# Altium schematic sheet SeaTurtleIO.SchDoc
size A3
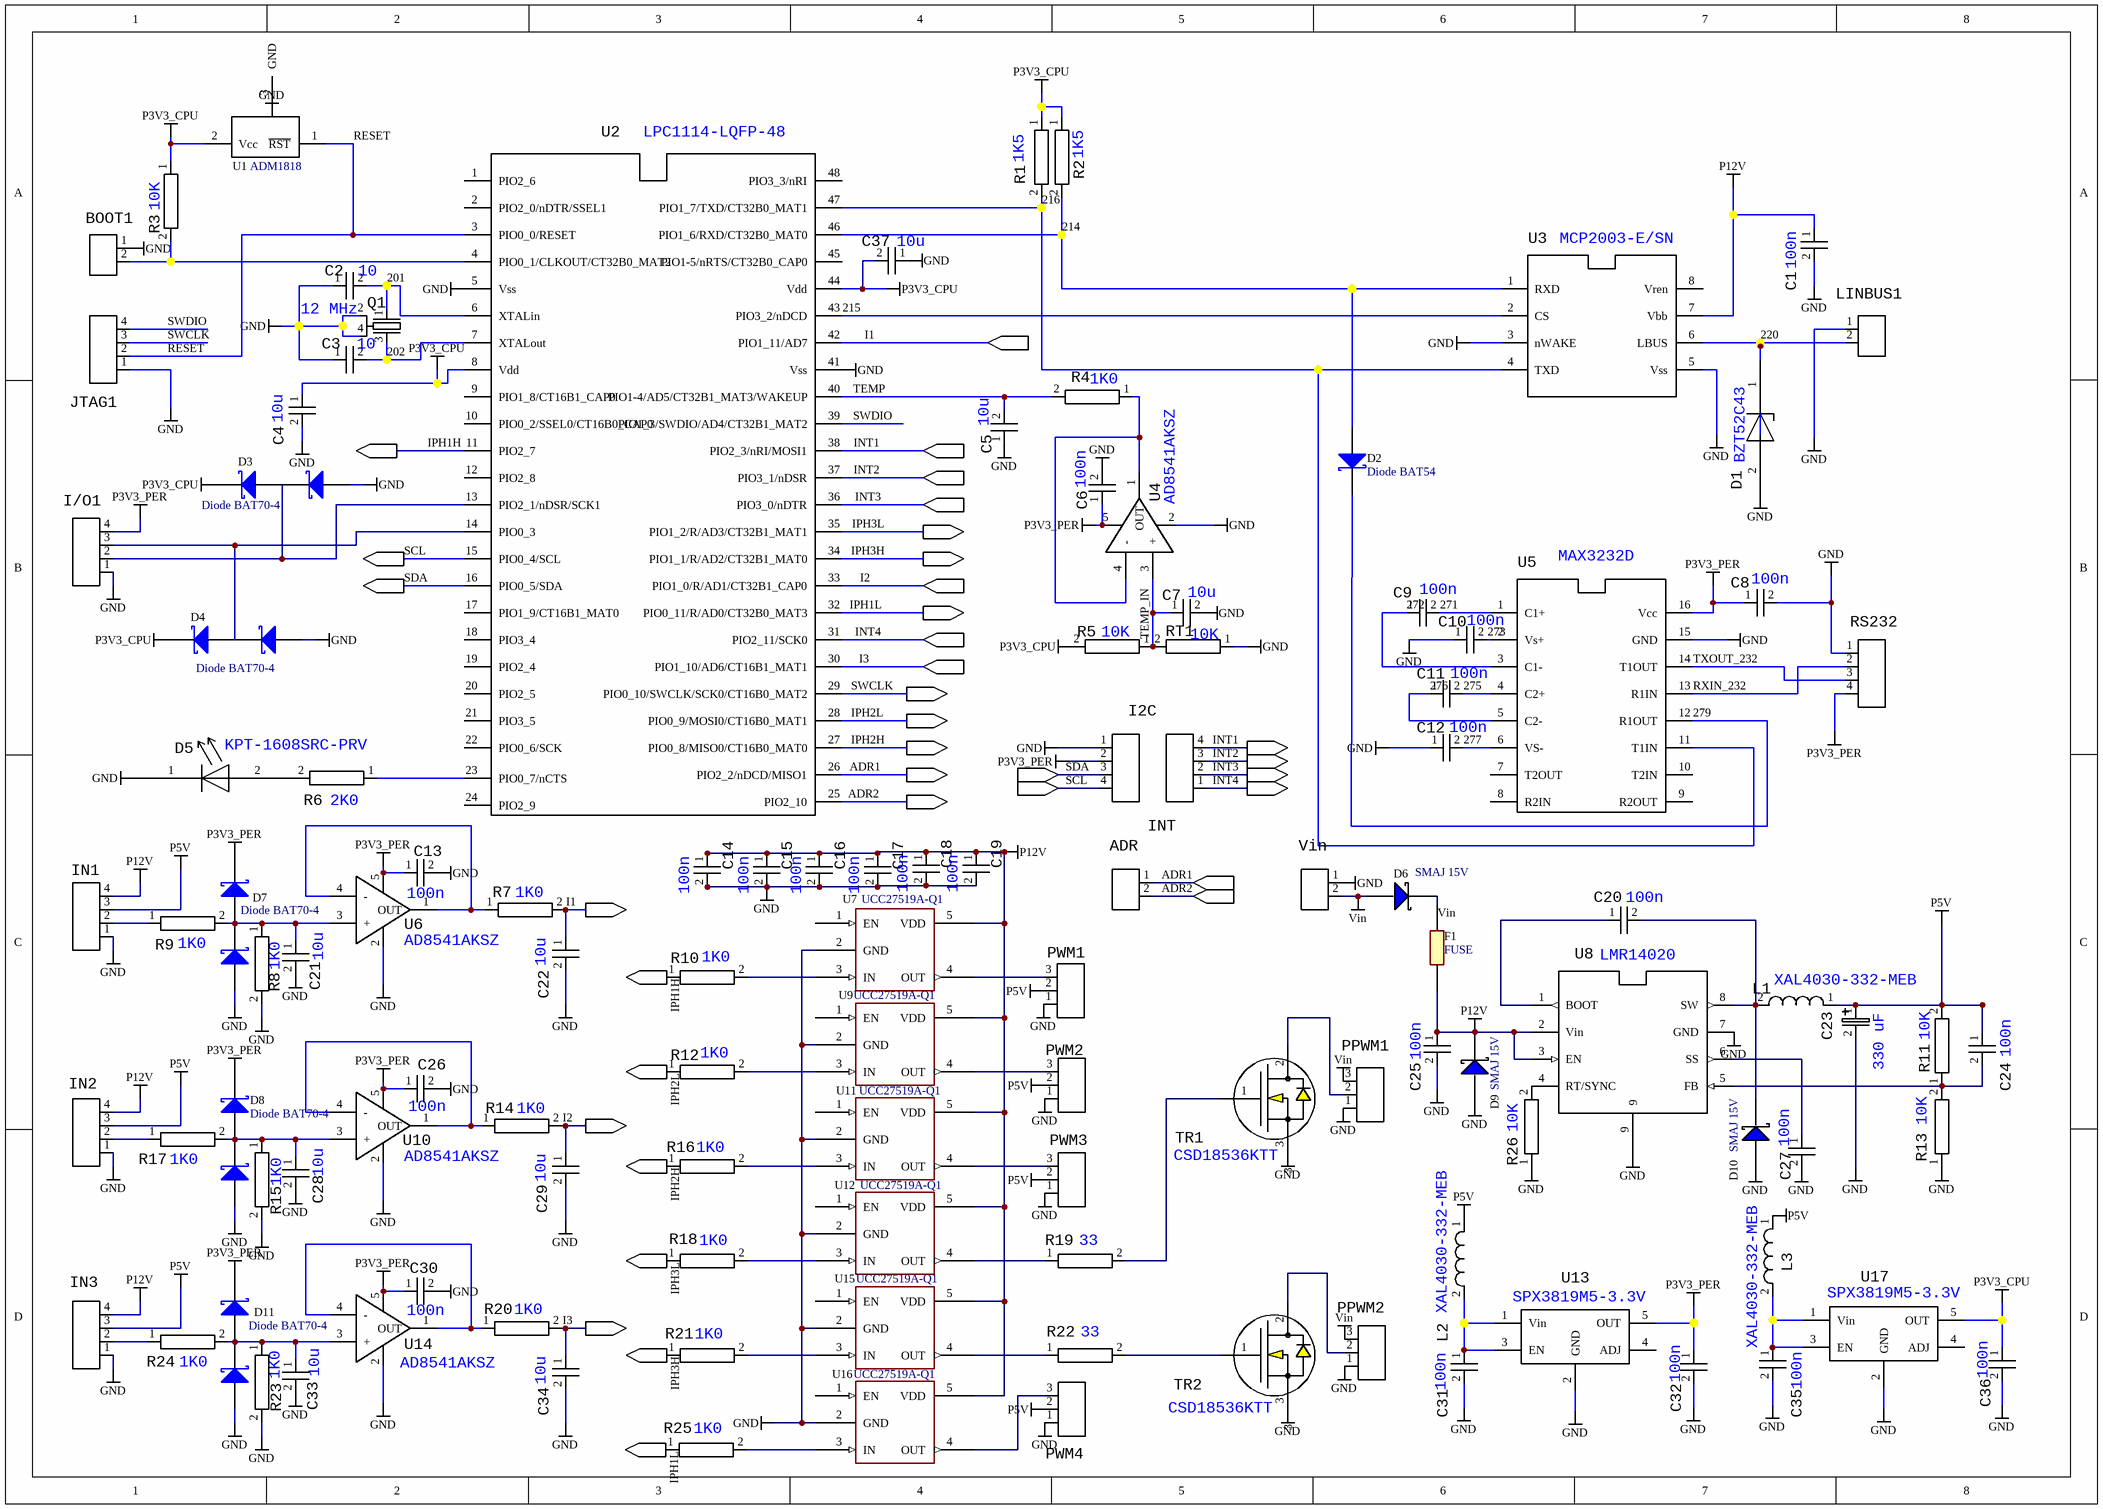
[diagram p0: SeaTurtleIO.SchDoc]

## Parts
(Parts that share a designator on the sheet are numbered #1, #2 ... from top to bottom, then left to right.)
?#1  SIGNALREF (externalin)  (value not drawn)  (graphical)
?#2  SIGNALREF (externalout)  (value not drawn)  (graphical)
?#3  SIGNALREF (externalin)  (value not drawn)  (graphical)
?#4  SIGNALREF (externalin)  (value not drawn)  (graphical)
?#5  SIGNALREF (externalin)  (value not drawn)  (graphical)
?#6  SIGNALREF (externalout)  (value not drawn)  (graphical)
?#7  SIGNALREF (externalout)  (value not drawn)  (graphical)
?#8  SIGNALREF (externalout)  (value not drawn)  (graphical)
?#9  SIGNALREF (externalout)  (value not drawn)  (graphical)
?#10  SIGNALREF (externalin)  (value not drawn)  (graphical)
?#11  SIGNALREF (externalout)  (value not drawn)  (graphical)
?#12  SIGNALREF (externalin)  (value not drawn)  (graphical)
?#13  SIGNALREF (externalout)  (value not drawn)  (graphical)
?#14  SIGNALREF (externalout)  (value not drawn)  (graphical)
?#15  SIGNALREF (externalout)  (value not drawn)  (graphical)
?#16  SIGNALREF (externalout)  (value not drawn)  (graphical)
?#17  SIGNALREF (externalout)  (value not drawn)  (graphical)
?#18  SIGNALREF (externalout)  (value not drawn)  (graphical)
?#19  SIGNALREF (externalout)  (value not drawn)  (graphical)
?#20  SIGNALREF (externalin)  (value not drawn)  (graphical)
?#21  SIGNALREF (externalout)  (value not drawn)  (graphical)
?#22  SIGNALREF (externalin)  (value not drawn)  (graphical)
?#23  SIGNALREF (externalout)  (value not drawn)  (graphical)
?#24  SIGNALREF (externalout)  (value not drawn)  (graphical)
?#25  SIGNALREF (externalin)  (value not drawn)  (graphical)
?#26  SIGNALREF (externalin)  (value not drawn)  (graphical)
?#27  SIGNALREF (externalout)  (value not drawn)  (graphical)
?#28  SIGNALREF (externalout)  (value not drawn)  (graphical)
?#29  SIGNALREF (externalout)  (value not drawn)  (graphical)
?#30  SIGNALREF (externalout)  (value not drawn)  (graphical)
?#31  SIGNALREF (externalout)  (value not drawn)  (graphical)
?#32  SIGNALREF (externalout)  (value not drawn)  (graphical)
?#33  SIGNALREF (externalout)  (value not drawn)  (graphical)
?#34  SIGNALREF (externalout)  (value not drawn)  (graphical)
?#35  SIGNALREF (externalout)  (value not drawn)  (graphical)
ADR  HEADER 2P S MALE  [con-srs-2-0254]  (value not drawn)
BOOT1  HEADER 2P S MALE  [con-srs-2-0254]  (value not drawn)
C1  100n  [1608[0603]]
C2  10  [1608[0603]]
C3  10  [1608[0603]]
C4  10u  [0805_N]
C5  10u  [0805_N]
C6  100n  [1608[0603]]
C7  10u  [0805_N]
C8  100n  [1608[0603]]
C9  100n  [1608[0603]]
C10  100n  [1608[0603]]
C11  100n  [1608[0603]]
C12  100n  [1608[0603]]
C13  100n  [1608[0603]]
C14  100n  [1608[0603]]
C15  100n  [1608[0603]]
C16  100n  [1608[0603]]
C17  100n  [1608[0603]]
C18  100n  [1608[0603]]
C19  100n  [1608[0603]]
C20  100n  [1608[0603]]
C21  10u  [0805_N]
C22  10u  [0805_N]
C23  330 uF  [CAP  POLAR 10RM5 (wave)]
C24  100n  [1608[0603]]
C25  100n  [1608[0603]]
C26  100n  [1608[0603]]
C27  100n  [1608[0603]]
C28  10u  [0805_N]
C29  10u  [0805_N]
C30  100n  [1608[0603]]
C31  100n  [1608[0603]]
C32  100n  [1608[0603]]
C33  10u  [0805_N]
C34  10u  [0805_N]
C35  100n  [1608[0603]]
C36  100n  [1608[0603]]
C37  10u  [0805_N]
D1  BZT52C43  [SOD123]
D2  Diode BAT54  [SOT-23_N]
D3  Diode BAT70-4  [SOT-23_N]
D4  Diode BAT70-4  [SOT-23_N]
D5  KPT-1608SRC-PRV
D6  SMAJ 15V  [SMA]
D7  Diode BAT70-4  [SOT-23_N]
D8  Diode BAT70-4  [SOT-23_N]
D9  SMAJ 15V  [SMA]
D10  SMAJ 15V  [SMA]
D11  Diode BAT70-4  [SOT-23_N]
F1  FUSE  [CAPC4532L]
I2C  HEADER 4P S MALE  [con-srs-4-0254]  (value not drawn)
I/O1  HEADER 4P S MALE  [con-srs-4-0254]  (value not drawn)
IN1  HEADER 4P S MALE  [con-srs-4-0254]  (value not drawn)
IN2  HEADER 4P S MALE  [con-srs-4-0254]  (value not drawn)
IN3  HEADER 4P S MALE  [con-srs-4-0254]  (value not drawn)
INT  HEADER 4P S MALE  [con-srs-4-0254]  (value not drawn)
JTAG1  HEADER 4P S MALE  [con-srs-4-0254]  (value not drawn)
L1  XAL4030-332-MEB
L2  XAL4030-332-MEB
L3  XAL4030-332-MEB
LINBUS1  HEADER 2P S MALE  [con-srs-2-0254]  (value not drawn)
PPWM1  HEADER 3P S MALE  [con-srs-3-0254]  (value not drawn)
PPWM2  HEADER 3P S MALE  [con-srs-3-0254]  (value not drawn)
PWM1  HEADER 3P S MALE  [con-srs-3-0254]  (value not drawn)
PWM2  HEADER 3P S MALE  [con-srs-3-0254]  (value not drawn)
PWM3  HEADER 3P S MALE  [con-srs-3-0254]  (value not drawn)
PWM4  HEADER 3P S MALE  [con-srs-3-0254]  (value not drawn)
Q1  12 MHz  [QUARTZ SMD QKT (QKT)]
R1  1K5  [1608[0603]]
R2  1K5  [1608[0603]]
R3  10K  [1608[0603]]
R4  1K0  [1608[0603]]
R5  10K  [1608[0603]]
R6  2K0  [1608[0603]]
R7  1K0  [1608[0603]]
R8  1K0  [1608[0603]]
R9  1K0  [1608[0603]]
R10  1K0  [1608[0603]]
R11  10K  [1608[0603]]
R12  1K0  [1608[0603]]
R13  10K  [1608[0603]]
R14  1K0  [1608[0603]]
R15  1K0  [1608[0603]]
R16  1K0  [1608[0603]]
R17  1K0  [1608[0603]]
R18  1K0  [1608[0603]]
R19  33  [0805_N]
R20  1K0  [1608[0603]]
R21  1K0  [1608[0603]]
R22  33  [0805_N]
R23  1K0  [1608[0603]]
R24  1K0  [1608[0603]]
R25  1K0  [1608[0603]]
R26  10K  [1608[0603]]
RS232  HEADER 4P S MALE  [con-srs-4-0254]  (value not drawn)
RT1  10K  [1608[0603]]
TR1  CSD18536KTT  [TO-263 (D2PAK)]
TR2  CSD18536KTT  [TO-263 (D2PAK)]
U1  ADM1818  [SOT-23_N]
U2  LPC1114-LQFP-48  [LQFP48_N]
U3  MCP2003-E/SN
U4  AD8541AKSZ
U5  MAX3232D
U6  AD8541AKSZ
U7  UCC27519A-Q1  [S_SOT23-5 (REFLOW)]
U8  LMR14020  [S_SO8_POWER_PAD (wave)]
U9  UCC27519A-Q1  [S_SOT23-5 (REFLOW)]
U10  AD8541AKSZ
U11  UCC27519A-Q1  [S_SOT23-5 (REFLOW)]
U12  UCC27519A-Q1  [S_SOT23-5 (REFLOW)]
U13  SPX3819M5-3.3V
U14  AD8541AKSZ
U15  UCC27519A-Q1  [S_SOT23-5 (REFLOW)]
U16  UCC27519A-Q1  [S_SOT23-5 (REFLOW)]
U17  SPX3819M5-3.3V
Vin  HEADER 2P S MALE  [con-srs-2-0254]  (value not drawn)

## Nets
GND: BOOT1.1 C1.2 C2.1 C3.1 C4.2 C5.1 C6.2 C7.2 C8.2 C10.1 C12.1 C13.2 C14.2 C15.2 C16.2 C17.2 C18.2 C19.2 C21.2 C22.2 C23.2 C25.2 C26.2 C27.2 C28.2 C29.2 C30.2 C31.2 C32.2 C33.2 C34.2 C35.2 C36.2 C37.1 D3.1(A) D4.1(A) D5.1 D7.1(A) D8.1(A) D9.1(A) D10.1(A) D11.1(A) I2C.1 I/O1.1 IN1.1 IN2.1 IN3.1 JTAG1.1 LINBUS1.1 PPWM1.1 PPWM2.1 PWM1.1 PWM2.1 PWM3.1 PWM4.1 Q1.2 Q1.4 R8.2 R13.1 R15.2 R23.2 R26.1 RS232.1 RT1.1 U1.3(GND) U2.5(Vss) U2.41(Vss) U3.3(nWAKE) U3.5(Vss) U4.2(GND) U5.15(GND) U6.2(GND) U7.2(GND) U8.7(GND) U8.9 U9.2(GND) U10.2(GND) U11.2(GND) U12.2(GND) U13.2(GND) U14.2(GND) U15.2(GND) U16.2(GND) U17.2(GND) Vin.1
P3V3_CPU: C4.1 C36.1 C37.2 D3.2(K) D4.2(K) R1.1 R2.1 R3.1 R5.2 U1.2(Vcc) U2.8(Vdd) U2.44(Vdd) U17.5(OUT)
P3V3_PER: C6.1 C8.1 C13.1 C26.1 C30.1 C32.1 D7.2(K) D8.2(K) D11.2(K) I2C.2 I/O1.4 RS232.4 U4.5(Vcc) U5.16(Vcc) U6.5(Vcc) U10.5(Vcc) U13.5(OUT) U14.5(Vcc)
P5V: C23.1 C24.1 IN1.3 IN2.3 IN3.3 L1.1 L2.1 L3.1 PWM1.2 PWM2.2 PWM3.2 PWM4.2 R11.2
P12V: C1.1 C14.1 C15.1 C16.1 C17.1 C18.1 C19.1 C25.1 D9.2(K) F1.1(A) IN1.4 IN2.4 IN3.4 U3.7(Vbb) U7.5(VDD) U8.2(Vin) U8.3(EN) U9.5(VDD) U11.5(VDD) U12.5(VDD) U15.5(VDD) U16.5(VDD)
Vin: D6.1(A) PPWM1.3 PPWM2.3 Vin.2
201: C2.2 Q1.1 U2.6(XTALin)
202: C3.2 Q1.3 U2.7(XTALout)
214: D2.1(A) R2.2 U2.46(PIO1_6/RXD/CT32B0_MAT0) U3.1(RXD)
215: U2.43(PIO3_2/nDCD) U3.2(CS)
216: R1.2 U2.47(PIO1_7/TXD/CT32B0_MAT1) U3.4(TXD) U5.11(T1IN)
220: D1.1 LINBUS1.2 U3.6(LBUS)
271: C9.2 U5.1(C1+)
272: C9.1 U5.3(C1-)
273: C10.2 U5.2(Vs+)
275: C11.2 U5.4(C2+)
276: C11.1 U5.5(C2-)
277: C12.2 U5.6(VS-)
279: D2.3(K) U5.12(R1OUT)
ADR1: ?#19.1 ?#25.1 ADR.1 U2.26(PIO2_2/nDCD/MISO1)
ADR2: ?#24.1 ?#26.1 ADR.2 U2.25(PIO2_10)
I1: ?#1.1 ?#27.1 C22.1 R7.2 U2.42(PIO1_11/AD7)
I2: ?#10.1 ?#30.1 C29.1 R14.2 U2.33(PIO1_0/R/AD1/CT32B1_CAP0)
I3: ?#33.1 C34.1 R20.2 U2.30(PIO1_10/AD6/CT16B1_MAT1)
INT1: ?#3.1 ?#17.1 INT.4 U2.38(PIO2_3/nRI/MOSI1)
INT2: ?#4.1 ?#18.1 INT.3 U2.37(PIO3_1/nDSR)
INT3: ?#5.1 ?#21.1 INT.2 U2.36(PIO3_0/nDTR)
INT4: ?#12.1 ?#23.1 INT.1 U2.31(PIO2_11/SCK0)
IPH1H: ?#2.1 ?#28.1 R10.1 U2.11(PIO2_7)
IPH1L: ?#11.1 ?#35.1 R25.1 U2.32(PIO0_11/R/AD0/CT32B0_MAT3)
IPH2H: ?#16.1 ?#31.1 R16.1 U2.27(PIO0_8/MISO0/CT16B0_MAT0)
IPH2L: ?#15.1 ?#29.1 R12.1 U2.28(PIO0_9/MOSI0/CT16B0_MAT1)
IPH3H: ?#8.1 ?#34.1 R21.1 U2.34(PIO1_1/R/AD2/CT32B1_MAT0)
IPH3L: ?#6.1 ?#32.1 R18.1 U2.35(PIO1_2/R/AD3/CT32B1_MAT1)
RESET: JTAG1.2 U1.1(~{RST}) U2.3(PIO0_0/RESET)
RXIN_232: RS232.2 U5.13(R1IN)
SCL: ?#7.1 ?#22.1 I2C.4 U2.15(PIO0_4/SCL)
SDA: ?#9.1 ?#20.1 I2C.3 U2.16(PIO0_5/SDA)
SWCLK: ?#14.1 JTAG1.3 U2.29(PIO0_10/SWCLK/SCK0/CT16B0_MAT2)
SWDIO: JTAG1.4 U2.39(PIO1_3/SWDIO/AD4/CT32B1_MAT2)
TEMP: C5.2 R4.2 U2.40(PIO1-4/AD5/CT32B1_MAT3/WAKEUP)
TEMP_IN: C7.1 R5.1 RT1.2 U4.3(+)
TXOUT_232: RS232.3 U5.14(T1OUT)
NetBOOT1_2: BOOT1.2 R3.2 U2.4(PIO0_1/CLKOUT/CT32B0_MAT2)
NetC20_1: C20.1 U8.1(BOOT)
NetC20_2: C20.2 D10.2(K) L1.2 U8.8(SW)
NetC21_1: C21.1 D7.3(KA) R8.1 R9.2 U6.3(+)
NetC24_2: C24.2 R11.1 R13.2 U8.5(FB)
NetC27_1: C27.1 U8.6(SS)
NetC28_1: C28.1 D8.3(KA) R15.1 R17.2 U10.3(+)
NetC31_1: C31.1 L2.2 U13.1(Vin) U13.3(EN)
NetC33_1: C33.1 D11.3(KA) R23.1 R24.2 U14.3(+)
NetC35_1: C35.1 L3.2 U17.1(Vin) U17.3(EN)
NetD3_3: D3.3(KA) I/O1.2 U2.13(PIO2_1/nDSR/SCK1)
NetD4_3: D4.3(KA) I/O1.3 U2.14(PIO0_3)
NetD5_2: D5.2 R6.2
NetD6_2: D6.2(K) F1.2(K)
NetIN1_2: IN1.2 R9.1
NetIN2_2: IN2.2 R17.1
NetIN3_2: IN3.2 R24.1
NetPPWM1_2: PPWM1.2 TR1.2
NetPPWM2_2: PPWM2.2 TR2.2
NetPWM1_3: PWM1.3 U7.4(OUT)
NetPWM2_3: PWM2.3 U9.4(OUT)
NetPWM3_3: PWM3.3 U11.4(OUT)
NetPWM4_3: PWM4.3 U16.4(OUT)
NetR4_1: R4.1 U4.1(OUT) U4.4(-)
NetR6_1: R6.1 U2.23(PIO0_7/nCTS)
NetR7_1: R7.1 U6.1(OUT) U6.4(-)
NetR10_2: R10.2 U7.3(IN)
NetR12_2: R12.2 U9.3(IN)
NetR14_1: R14.1 U10.1(OUT) U10.4(-)
NetR16_2: R16.2 U11.3(IN)
NetR18_2: R18.2 U12.3(IN)
NetR19_1: R19.1 U12.4(OUT)
NetR19_2: R19.2 TR1.1
NetR20_1: R20.1 U14.1(OUT) U14.4(-)
NetR21_2: R21.2 U15.3(IN)
NetR22_1: R22.1 U15.4(OUT)
NetR22_2: R22.2 TR2.1
NetR25_2: R25.2 U16.3(IN)
NetR26_2: R26.2 U8.4(RT/SYNC)

Not connected (* = marked no-connect by the designer): ?#13 1; D1 2; TR1 3; TR2 3; U2 1(PIO2_6) 2(PIO2_0/nDTR/SSEL1) 9(PIO1_8/CT16B1_CAP0) 10(PIO0_2/SSEL0/CT16B0_CAP0) 12(PIO2_8) 17(PIO1_9/CT16B1_MAT0) 18(PIO3_4) 19(PIO2_4) 20(PIO2_5) 21(PIO3_5) 22(PIO0_6/SCK) 24(PIO2_9) 45(PIO1-5/nRTS/CT32B0_CAP0) 48(PIO3_3/nRI); U3 8(Vren); U5 7(T2OUT) 8(R2IN) 9(R2OUT) 10(T2IN); U7 1(EN); U9 1(EN); U11 1(EN); U12 1(EN); U13 4(ADJ); U15 1(EN); U16 1(EN); U17 4(ADJ)

## Notes on the sheet
- Labels drawn without touching a wire or pin: GND, Vin

## Library data of the parts
ADR BOOT1 LINBUS1 Vin = HEADER 2P S MALE: HEADER SINGLE ROW 2P STRAIGHT MALE; Elec_type: ON_BOARD_CONNECTOR; (OldCtfName): (CTF_OLD_NAME_INVALID)
C1 C6 C8-C20 C24-C27 C30-C32 C35 C36 = C100n-10%-0603: 100n Surface mount CAP 10% 25V; (OldCtfName): (CTF_OLD_NAME_INVALID); Value: 100n; Tolerance: 10%; Voltage: 25V
C2 C3 = C10-10%-0603: 10p Surface mount CAP 10% 25V; (OldCtfName): (CTF_OLD_NAME_INVALID); Value: 10; Tolerance: 10%; Voltage: 25V
C4 C5 C7 C21 C22 C28 C29 C33 C34 C37 = C10u-10%-0805: 10u Surface mount CAP 0805 10% 25V; (OldCtfName): (CTF_OLD_NAME_INVALID); Value: 10u; Tolerance: 10%; Voltage: 25V
C23 = C330uF-63V--Polar: Voltage: 63V; Tolerance: 20%; (OldCtfName): (CTF_OLD_NAME_INVALID); Value: 330 uF
D1 = BZT52C43: ZENER DIODE 43V; Manufacturer: DIODES; (OldCtfName): (CTF_OLD_NAME_INVALID); Value: BZT52C43
D2 = Diode BAT17: Silicon RF Schottky Diode for Mixer Applications in the VHF/UHF Range; Note: Pin 2 is not connected and not drawn.; Published: 21-Mar-2003; LatestRevisionDate: 29-May-2009; LatestRevisionNote: IPC-7351 Footprint Added.; DatasheetVersion: Oct-1999; PackageVersion: Sep-2001; PackageReference: SOT-23; Publisher: Altium Limited; PackageDescription: 3-Pin SOT-23 Package 0.95 mm Pitch, 2.5 mm Lead Span; ComponentLink1Description: Manufacturer Link; ComponentLink1URL: http://www.infineon.com/; ComponentLink2Description: Datasheet; ComponentLink2URL: http://www.infineon.com/upload/Document/cmc_upload/documents/009/363/bat17series.pdf
D3 D4 D7 D8 D11 = Diode BAS70-04: Silicon RF Schottky Diode for Mixer Applications in the VHF/UHF Range; Note: Pin 2 is not connected and not drawn.; Published: 21-Mar-2003; LatestRevisionDate: 29-May-2009; LatestRevisionNote: IPC-7351 Footprint Added.; DatasheetVersion: Oct-1999; PackageVersion: Sep-2001; PackageReference: SOT-23; Publisher: Altium Limited; PackageDescription: 3-Pin SOT-23 Package 0.95 mm Pitch, 2.5 mm Lead Span; ComponentLink1Description: Manufacturer Link; ComponentLink1URL: http://www.infineon.com/; ComponentLink2Description: Datasheet; ComponentLink2URL: http://www.infineon.com/upload/Document/cmc_upload/documents/009/363/bat17series.pdf
D5 = KPT-1608SRC-PRV: LED SMD RED        0603; Manufacturer: KINGBRIGHT; (OldCtfName): (CTF_OLD_NAME_INVALID); Value: KPT-1608SRC-PRV
D6 D9 D10 = TVS_SMAJ15: TVS
F1 = FUSE_1A: FUSE POLISWITCH
I2C I/O1 IN1-IN3 INT JTAG1 RS232 = HEADER 4P S MALE: HEADER SINGLE ROW 4P STRAIGHT MALE; Elec_type: ON_BOARD_CONNECTOR; (OldCtfName): (CTF_OLD_NAME_INVALID)
L1-L3 = XAL4030-332-MEB: XAL4030-332-MEB - INDUCTOR 33 uH; Tolerance: 20%; (OldCtfName): (CTF_OLD_NAME_INVALID); Elec_type: XAL4030-332-MEB; Value: XAL4030-332-MEB
PPWM1 PPWM2 PWM1-PWM4 = HEADER 3P S MALE: HEADER SINGLE ROW 3P STRAIGHT MALE; Elec_type: ON_BOARD_CONNECTOR; (OldCtfName): (CTF_OLD_NAME_INVALID)
Q1 = Q-12MHz-QKT_SMD: Quartz resonator QKT SMD case; (OldCtfName): (CTF_OLD_NAME_INVALID); Value: 12 MHz
R1 R2 = R1K5-1%-0805: 1K5 SMD 0805 1%; Wattage: 0.25W; (OldCtfName): (CTF_OLD_NAME_INVALID); Value: 1K5; Tolerance: 1%
R3 R5 R11 R13 R26 RT1 = R10K-1%-0603: 10K SMD 0603 1%; Wattage: 0.065W; (OldCtfName): (CTF_OLD_NAME_INVALID); Value: 10K; Tolerance: 1%
R4 R7-R10 R12 R14-R18 R20 R21 R23-R25 = R1K0-1%-0603: 1K0 SMD 0603 1%; Wattage: 0.065W; (OldCtfName): (CTF_OLD_NAME_INVALID); Value: 1K0; Tolerance: 1%
R6 = R2K0-1%-0603: 2K0 SMD 0603 1%; Wattage: 0.065W; (OldCtfName): (CTF_OLD_NAME_INVALID); Value: 2K0; Tolerance: 1%
R19 R22 = R33-1%-0805: 33R SMD 0805 1%; Wattage: 0.25W; (OldCtfName): (CTF_OLD_NAME_INVALID); Value: 33; Tolerance: 1%
TR1 TR2 = CSD18536KTT: N-CHANNEL MOSFET DPAK; Manufacturer: TI; (OldCtfName): (CTF_OLD_NAME_INVALID); Value: CSD18536KTT
U1 = ADM1818: MCU Reset IC; Note: Pin 2 is not connected and not drawn.; PackageVersion: Sep-2001; PackageReference: SOT-23; PackageDescription: 3-Pin SOT-23 Package 0.95 mm Pitch, 2.5 mm Lead Span; Published: 21-Mar-2003; LatestRevisionDate: 29-May-2009; LatestRevisionNote: IPC-7351 Footprint Added.; DatasheetVersion: Oct-1999
U2 = LPC1114-LQFP-48: NXP ARM 32BIT MPU; (OldCtfName): (CTF_OLD_NAME_INVALID); Value: LPC1114-LQFP-48; Manufacturer: NXP
U3 = MCP2003-E/SN: LIN DRIVER; Manufacturer: MICROCHIP; (OldCtfName): (CTF_OLD_NAME_INVALID); Value: MCP2003-E/SN
U4 U6 U10 U14 = AD8541AKSZ: RAIL-TO-RAIL OPERATIONAL AMP; Manufacturer: ANALOG DEVICES; (OldCtfName): (CTF_OLD_NAME_INVALID); Value: AD8541AKSZ
U5 = MAX232D: RS-232 TRANSCEIVER; Manufacturer: TEXAS; thm_power_diss: 0.2275; (OldCtfName): (CTF_OLD_NAME_INVALID); Value: MAX3232D
U7 U9 U11 U12 U15 U16 = UCC27519A-Q1: MOSFET gate driver; Value: UCC27519A-Q1
U8 = LMR14020: 4-40V to 3.3V Buck; Manufacturer: TI; (OldCtfName): (CTF_OLD_NAME_INVALID); Value: LMR14020
U13 U17 = SPX1819M5-3.3V: POS VOLTAGE REGULATOR FIXED 3.3V; Manufacturer: EXAR; (OldCtfName): (CTF_OLD_NAME_INVALID); Value: SPX3819M5-3.3V